# EAGLE design xo106 (EAGLE 7.7.0)
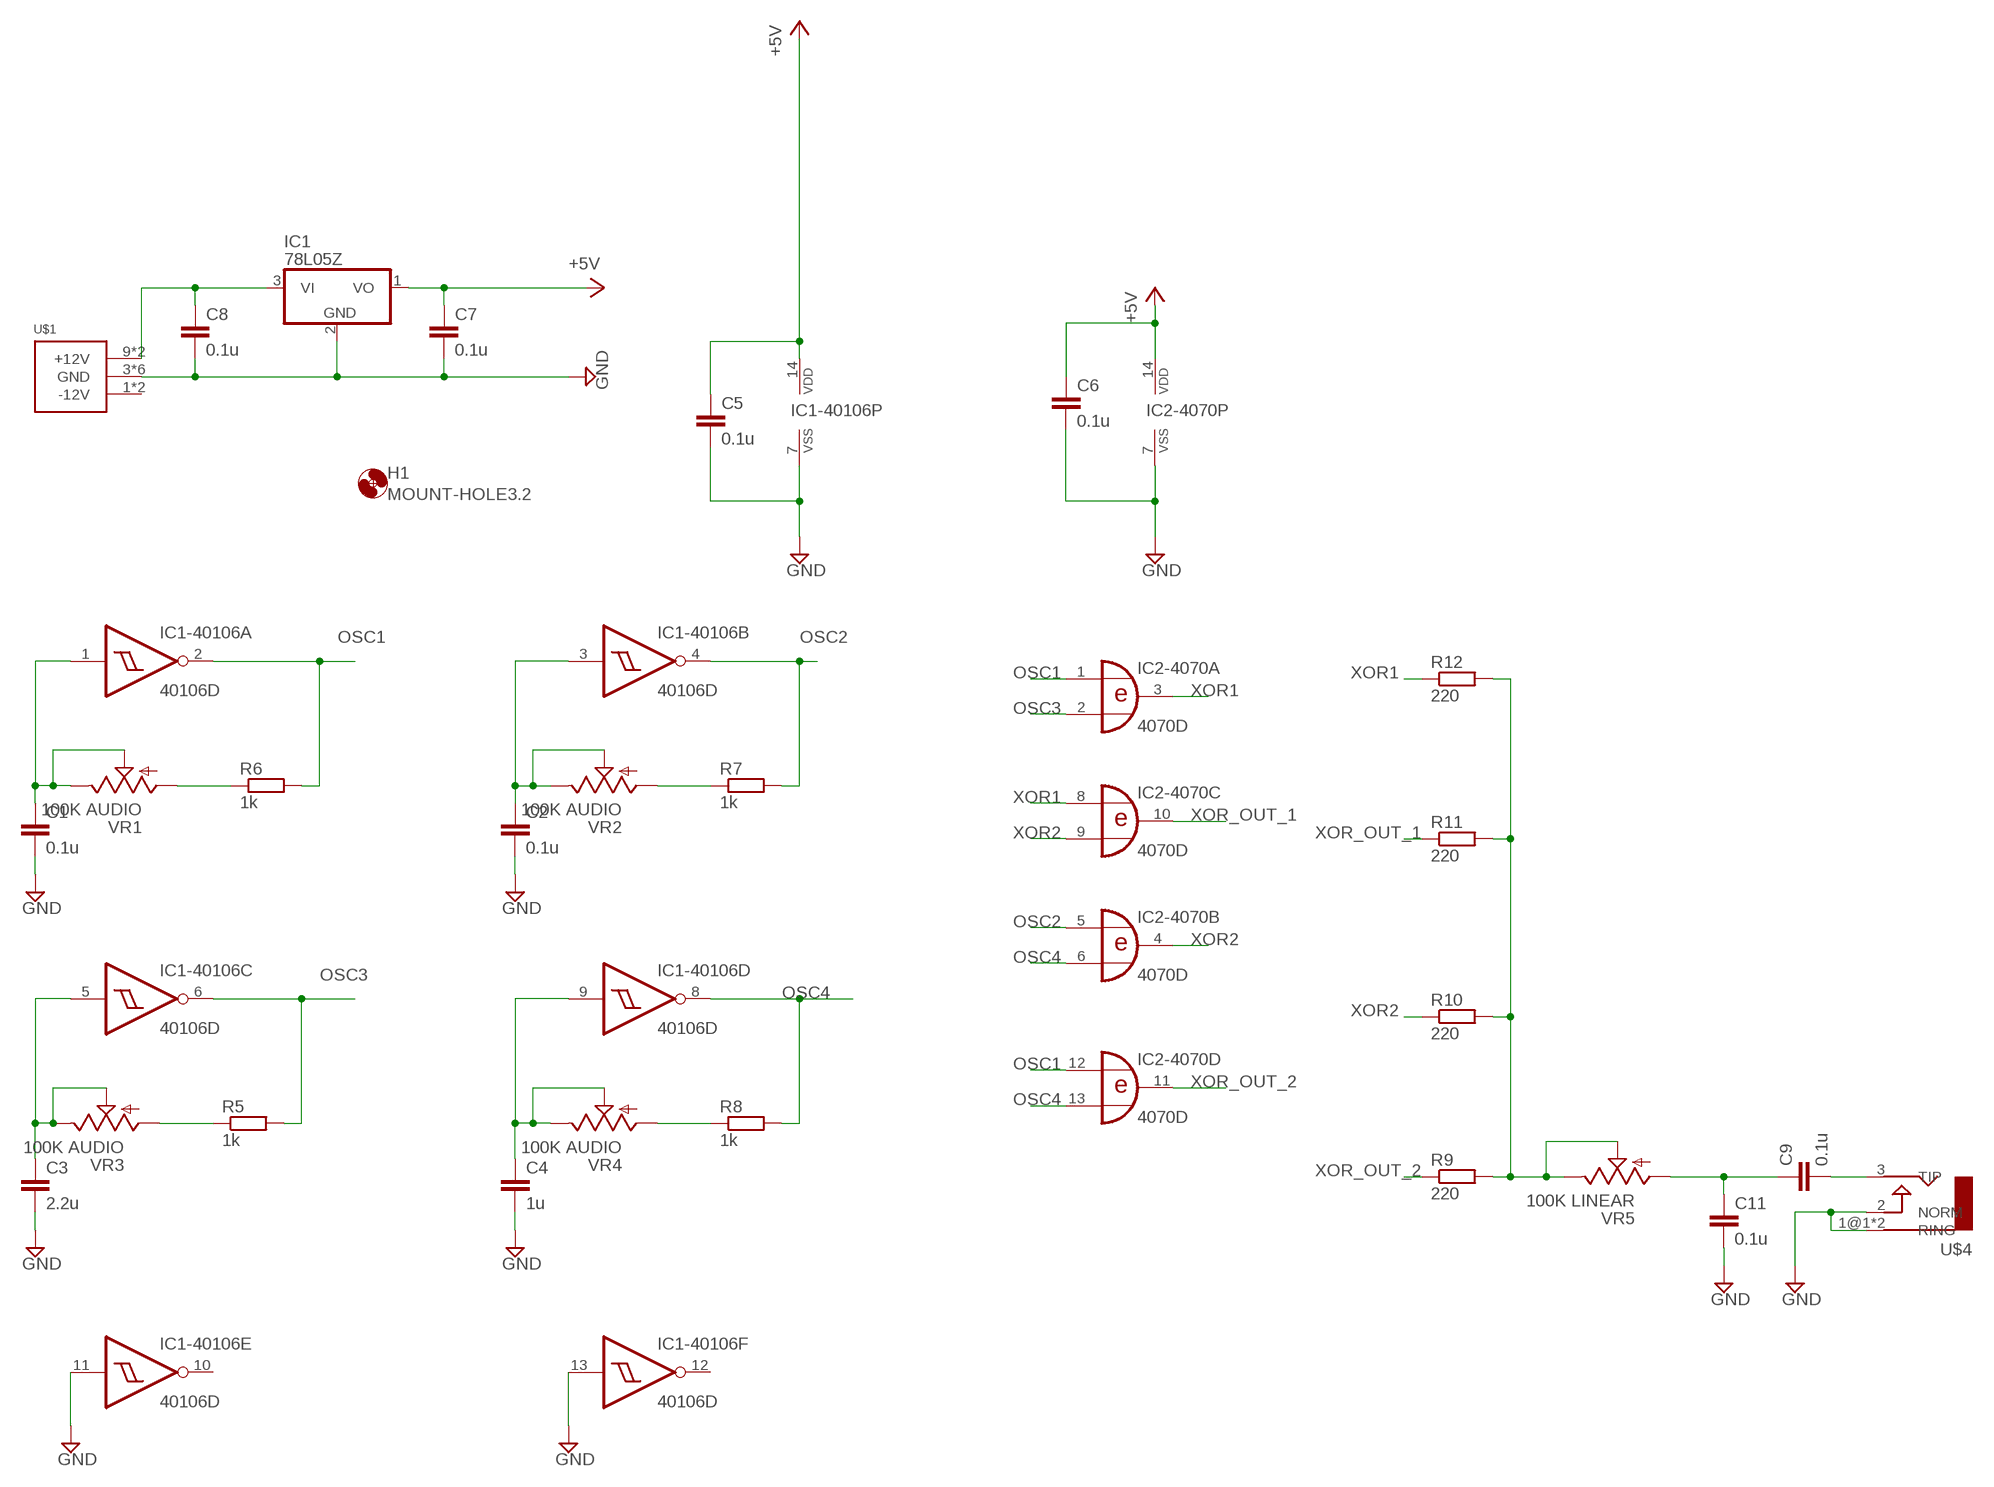
[diagram p0: schematic, sheet 1]

## Parts
C1  0.1u  C-EUC0805  [C0805]
C2  0.1u  C-EUC0805  [C0805]
C3  2.2u  C-EUC0805  [C0805]
C4  1u  C-EUC0805  [C0805]
C5  0.1u  C-EUC0805  [C0805]
C6  0.1u  C-EUC0805  [C0805]
C7  0.1u  C-EUC0805  [C0805]
C8  0.1u  C-EUC0805  [C0805]
C9  0.1u  C-EUC0805  [C0805]
C11  0.1u  C-EU050-025X075  [C050-025X075]
H1  MOUNT-HOLE3.2  [3,2]
IC1  78L05Z  [TO92]
IC1-40106  40106D  [SO14]
IC2-4070  4070D  [SO14]
R5  1k  R-EU_R0805  [R0805]
R6  1k  R-EU_R0805  [R0805]
R7  1k  R-EU_R0805  [R0805]
R8  1k  R-EU_R0805  [R0805]
R9  220  R-EU_R0805  [R0805]
R10  220  R-EU_R0805  [R0805]
R11  220  R-EU_M0805  [M0805]
R12  220  R-EU_R0805  [R0805]
U$1  POWER_SIMPLE10  [POWER_10]
U$4  AUDIO-JACKERTHENVAR  [ERTHENVAR-JACK]
VR1  100K AUDIO  9MM_SNAP-IN_POT_  [9MM_SNAP-IN_POT]
VR2  100K AUDIO  9MM_SNAP-IN_POT_  [9MM_SNAP-IN_POT]
VR3  100K AUDIO  9MM_SNAP-IN_POT_  [9MM_SNAP-IN_POT]
VR4  100K AUDIO  9MM_SNAP-IN_POT_  [9MM_SNAP-IN_POT]
VR5  100K LINEAR  9MM_SNAP-IN_POT_  [9MM_SNAP-IN_POT]

## Nets
+5V: C5.1 C6.1 C7.1 IC1-40106.14(P:VDD) IC1.1(VO) IC2-4070.14(P:VDD)
GND: C1.2 C2.2 C3.2 C4.2 C5.2 C6.2 C7.2 C8.2 C11.2 IC1-40106.7(P:VSS) IC1-40106.11(E:I) IC1-40106.13(F:I) IC1.2(GND) IC2-4070.7(P:VSS) U$1.3(GND) U$1.4(GND) U$1.5(GND) U$1.6(GND) U$1.7(GND) U$1.8(GND) U$4.1@1(RING) U$4.1@2(RING) U$4.2(NORM)
N$1: C9.1 C11.1 VR5.1(A)
N$2: R6.1 VR1.1(A)
N$3: R5.1 VR3.1(A)
N$4: R8.1 VR4.1(A)
N$5: C1.1 IC1-40106.1(A:I) VR1.2(S) VR1.3(E)
N$6: C2.1 IC1-40106.3(B:I) VR2.2(S) VR2.3(E)
N$7: C3.1 IC1-40106.5(C:I) VR3.2(S) VR3.3(E)
N$8: C4.1 IC1-40106.9(D:I) VR4.2(S) VR4.3(E)
N$9: R7.1 VR2.1(A)
N$10: C8.1 IC1.3(VI) U$1.9(+12V) U$1.10(+12V)
N$11: C9.2 U$4.3(TIP)
N$15: R9.2 R10.2 R11.2 R12.2 VR5.2(S) VR5.3(E)
OSC1: IC1-40106.2(A:O) IC2-4070.1(A:I0) IC2-4070.12(D:I0) R6.2
OSC2: IC1-40106.4(B:O) IC2-4070.5(B:I0) R7.2
OSC3: IC1-40106.6(C:O) IC2-4070.2(A:I1) R5.2
OSC4: IC1-40106.8(D:O) IC2-4070.6(B:I1) IC2-4070.13(D:I1) R8.2
XOR1: IC2-4070.3(A:O) IC2-4070.8(C:I0) R12.1
XOR2: IC2-4070.4(B:O) IC2-4070.9(C:I1) R10.1
XOR_OUT_1: IC2-4070.10(C:O) R11.1
XOR_OUT_2: IC2-4070.11(D:O) R9.1
Unconnected: IC1-40106.10(E:O) IC1-40106.12(F:O) U$1.1(-12V) U$1.2(-12V)

## Library data of the parts
C1-C9 C11 = rcl:C-EU: CAPACITOR, European symbol
H1 = holes:MOUNT-HOLE: MOUNTING HOLE with drill center marker
IC1 = linear:78*: Positive VOLTAGE REGULATOR Source: http://cache.national.com/ds/LM/LM78L05.pdf http://www.fairchildsemi.com/ds/LM/LM7805.pdf
IC1-40106 = 40xx:40106: Hex SCHMITT TRIGGER
IC2-4070 = 40xx:4070: Quad 2-input XOR
R5-R12 = resistor:R-EU_: RESISTOR, European symbol
U$1 = eurorack:POWER_SIMPLE
U$4 = erthenvar:AUDIO-JACK: Switching Mono 3.5mm Audio Jack from Erthenvar.
VR1-VR5 = MusicThingModular:9MM_SNAP-IN_POT: 9mm vertical snap-in pot, Alpha / Panasonic style

## Board
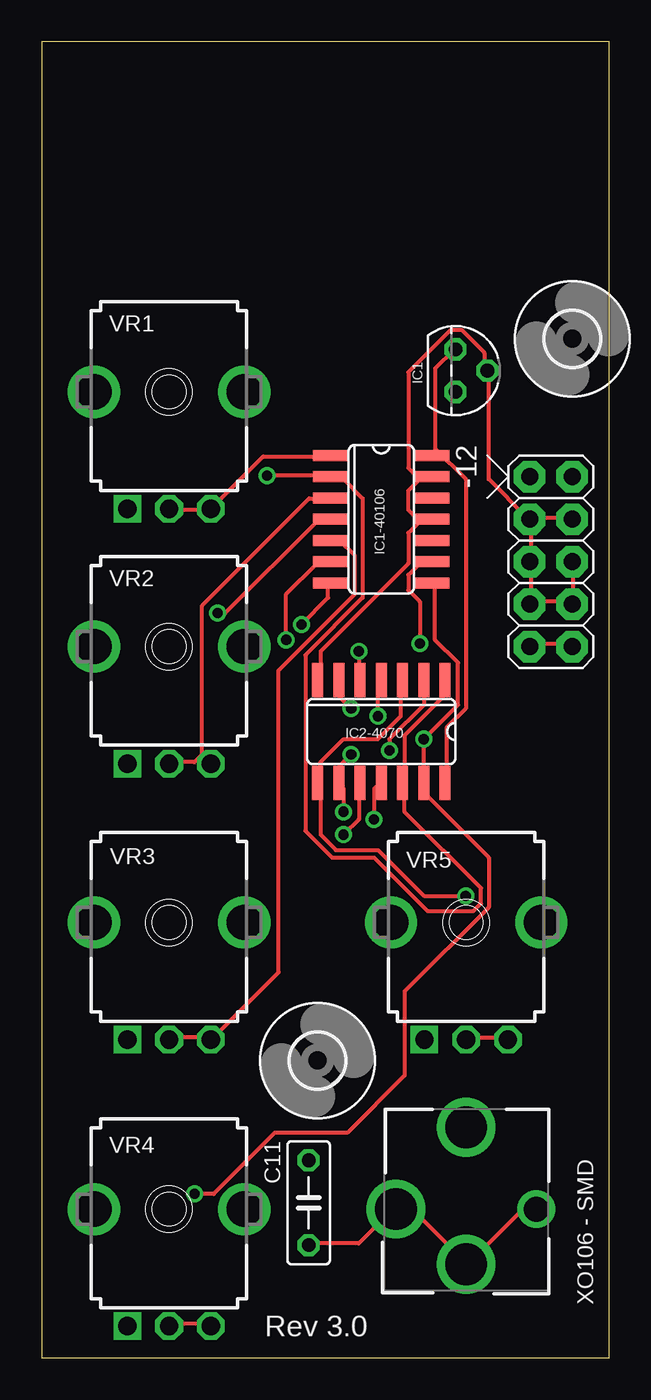
[diagram p1: board, top side]
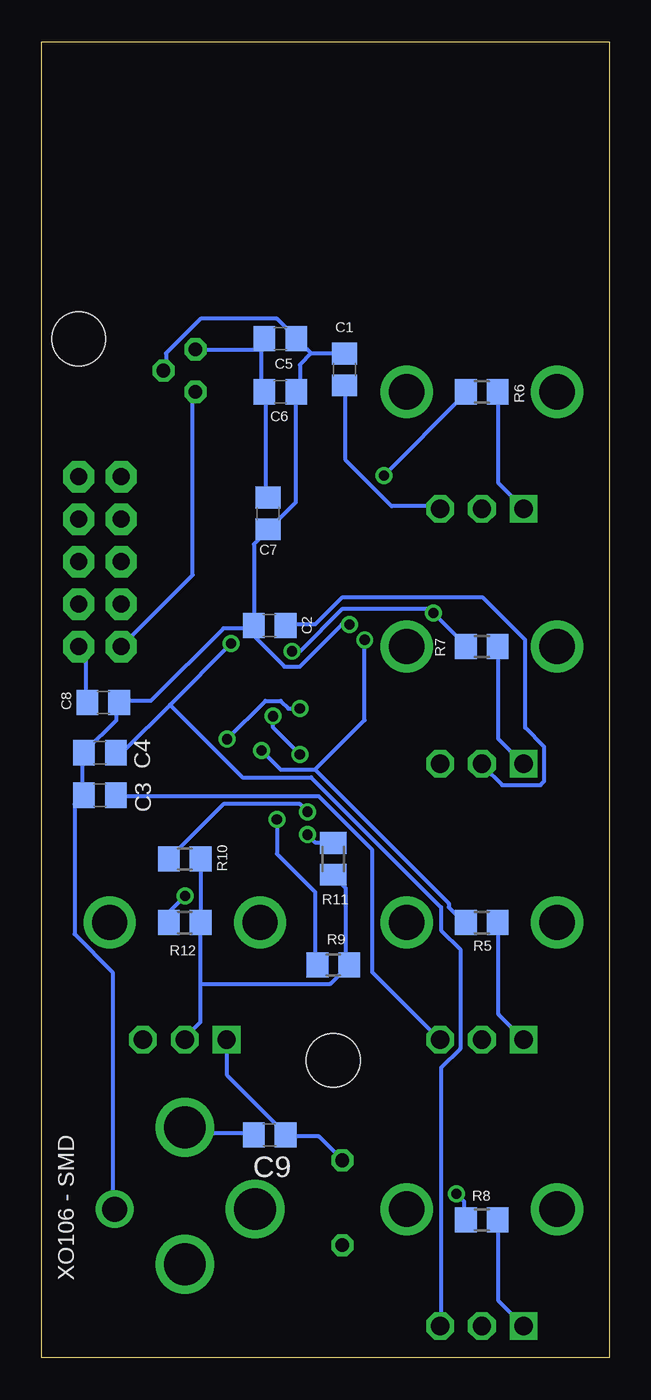
[diagram p2: board, bottom side, seen from below]

Size 33.96 x 78.73 mm. Coordinates in mm from the lower left corner, seen from the top.
Outline: 0,0 33.96,0 33.96,78.73 0,78.73 0,0
Copper layers (1*16): Top 0.035mm / dielectric 1.5mm / Bottom 0.035mm
Design rules "default": minimum track width 10mil, minimum drill 24mil, track to track 8mil, track to pad 8mil, pad to pad 8mil, via to via 8mil, smd to smd 8mil, copper to edge 40mil, drill to drill 8mil, minimum pad ring 10mil, minimum via ring 8mil, stop-mask expansion 4mil, vias tented up to drill 0mil, thermal gap 10mil

### Footprints (pad centres in the part's own frame; a part is rotated, then mirrored left to right if it is on the bottom)
C0805 = smd 1.3 x 1.5: 1 -0.95,0; 2 0.95,0
C050-025X075 = drill 0.813 octagon: 1 -2.54,0; 2 2.54,0
3,2 = hole 3.2: 0,0
TO92 = drill 0.813 octagon: 1 -1.27,0; 2 0,1.905; 3 1.27,0
SO14 = smd 0.66 x 2.032: 1 -3.81,-3.073; 2 -2.54,-3.073; 3 -1.27,-3.073; 4 0,-3.073; 5 1.27,-3.073; 6 2.54,-3.073; 7 3.81,-3.073; 8 3.81,3.073; 9 2.54,3.073; 10 1.27,3.073; 11 0,3.073; 12 -1.27,3.073; 13 -2.54,3.073; 14 -3.81,3.073
R0805 = smd 1.3 x 1.5: 1 -0.95,0; 2 0.95,0
M0805 = smd 1.3 x 1.6: 1 -0.95,0; 2 0.95,0
POWER_10 = drill 1.016 pad 1.88 octagon: 1 -5.08,-1.27; 2 -5.08,1.27; 3 -2.54,-1.27; 4 -2.54,1.27; 5 0,-1.27; 6 0,1.27; 7 2.54,-1.27; 8 2.54,1.27; 9 5.08,-1.27; 10 5.08,1.27
ERTHENVAR-JACK = drill 2.5: 1@1 -4.2,0; 2 0,-3.3; 3 0,4.9 | drill 1.5: 1@2 4.2,0
9MM_SNAP-IN_POT = drill 1.1 square: 1 -2.5,-7 | drill 1.1 octagon: 2 0,-7; 3 2.5,-7 | drill 2.1 pad 2.794: CHASSIS1 -4.5,0; CHASSIS2 4.5,0

### Placement (x,y rotation side)
C1  15.83,59.12 90 bottom
C2  20.32,43.82 180 bottom
C3  30.48,33.66 180 bottom
C4  30.48,36.2 180 bottom
C5  19.68,60.96 0 bottom
C6  19.68,57.79 0 bottom
C7  20.42,50.51 270 bottom
C8  30.27,39.21 0 bottom
C9  20.32,13.34 180 bottom
C11  15.97,9.27 270 top
H1  31.75,60.96 0 top
H2  MOUNT-HOLE3.2  [3,2]  16.51,17.78 0 top
IC1  24.77,59.05 270 top
IC1-40106  20.32,50.16 270 top
IC2-4070  20.32,37.47 180 top
R5  7.62,26.04 180 bottom
R6  7.62,57.79 180 bottom
R7  7.62,42.55 180 bottom
R8  7.62,8.26 180 bottom
R9  16.51,23.49 0 bottom
R10  25.4,29.84 0 bottom
R11  16.51,29.84 270 bottom
R12  25.4,26.04 0 bottom
U$1  30.48,47.62 270 top
U$4  25.4,8.89 0 top
VR1  7.62,57.79 0 top
VR2  7.62,42.55 0 top
VR3  7.62,26.04 0 top
VR4  7.62,8.89 0 top
VR5  25.4,26.04 0 top

### Tracks (layer width: path | path; a pad name or v marks a point on that pad's centre or on a via)
+5V
  Top 0.254: 23.55,54.38 23.55,59.18 24.69,60.33 IC1.1 | 23.55,54.38 23.55,54.15 IC1-40106.14 | 23.55,54.38 25.38,52.55 25.38,38.84 24.23,37.69 24.23,34.49 IC2-4070.14
  Bottom 0.254: C7.1 20.57,51.64 20.57,57.58 C6.1 20.8,57.81 20.8,60.33 | 20.8,60.33 20.8,60.78 C5.1 20.8,60.33 | IC1.1 20.8,60.33
GND  (via drill 0.61)
  Top 0.254: 22.63,50.04 21.95,49.35 21.95,47.52 16.69,42.27 16.69,40.66 IC2-4070.7 | 22.63,50.04 23.32,50.04 IC1-40106.11 22.63,50.04 | 22.63,52.55 23.32,52.55 IC1-40106.13 22.63,52.55 | 22.63,52.55 21.95,51.87 21.95,50.72 22.63,50.04 | 29.26,45.24 29.26,47.52 U$1.5 29.26,47.75 29.26,50.04 U$1.3 | U$1.6 31.77,47.52 31.77,45.24 U$1.8 31.55,45.24 29.26,45.24 | 29.26,45.24 U$1.7 | U$1.3 29.03,50.27 26.75,52.55 26.75,58.95 IC1.2 26.52,59.18 26.52,60.1 25.15,61.47 24.46,61.47 21.95,58.95 21.95,53.24 22.63,52.55 | U$1.4 31.55,50.27 29.26,50.27 U$1.3 | C11.2 16,6.83 18.97,6.83 21.03,8.89 U$4.1@1 22.17,8.89 25.38,5.69 U$4.2 25.6,5.69 28.8,8.89 U$4.1@2 | v15.54,43.87 17.14,45.47 17.14,46.15 IC1-40106.7
  Bottom 0.254: 17.83,60.1 16,60.1 C1.2 | 17.83,60.1 18.52,60.78 C5.2 18.75,61.01 19.89,62.15 24.46,62.15 26.52,60.1 26.52,59.18 IC1.2 | 17.83,60.1 18.52,59.41 18.52,57.81 C6.2 18.75,57.58 18.75,51.18 20.34,49.58 C7.2 20.57,49.35 21.26,48.67 21.26,43.87 C2.2 | v15.54,43.87 16,43.87 18.52,41.35 19.43,41.35 21.26,43.18 21.26,43.64 C2.2 | C2.2 21.49,43.64 23.09,43.64 27.43,39.29 29.26,39.29 C8.2 29.49,39.07 29.49,38.15 31.32,36.32 C4.2 31.55,36.09 31.55,33.81 C3.2 31.55,33.58 32,33.12 32,25.35 29.72,23.06 29.72,8.89 U$4.1@2
N$1
  Bottom 0.254: C11.1 16,11.86 17.37,13.23 19.2,13.23 C9.1 19.43,13.46 22.86,16.89 22.86,18.95 VR5.1
N$2
  Bottom 0.254: R6.1 6.63,57.58 6.63,52.32 5.26,50.95 VR1.1
N$3
  Bottom 0.254: R5.1 6.63,26.04 6.63,20.55 5.26,19.18 VR3.1
N$4
  Bottom 0.254: R8.1 6.63,8.2 6.63,3.4 5.26,2.03 VR4.1
N$5
  Top 0.254: IC1-40106.1 17.14,53.92 13.26,53.92 10.29,50.95 VR1.3 10.06,50.72 7.77,50.72 VR1.2
  Bottom 0.254: C1.1 15.77,58.04 15.77,53.7 13.03,50.95 10.29,50.95 VR1.3
N$6
  Top 0.254: 9.6,36.09 9.6,45.01 16,51.41 17.14,51.41 IC1-40106.3 | 9.6,36.09 10.06,35.64 VR2.3 9.6,36.09 | 9.6,36.09 9.14,35.64 7.77,35.64 VR2.2
  Bottom 0.254: C2.1 19.2,43.87 17.6,43.87 16,45.47 7.54,45.47 5.03,42.95 5.03,37.69 3.89,36.55 3.89,34.49 4.12,34.27 6.4,34.27 7.54,35.41 VR2.2
N$7
  Top 0.254: IC1-40106.5 17.83,48.9 18.75,47.98 18.75,45.7 14.17,41.12 14.17,23.06 10.29,19.18 VR3.3 10.06,19.18 7.77,19.18 VR3.2
  Bottom 0.254: C3.1 29.49,33.58 17.37,33.58 14.17,30.38 14.17,23.06 10.29,19.18 VR3.3
N$8  (via drill 0.61)
  Top 0.254: VR4.2 7.77,2.03 10.06,2.03 VR4.3 | v22.63,42.72 22.63,45.24 21.95,45.92 21.95,46.84 22.63,47.52 23.32,47.52 IC1-40106.9
  Bottom 0.254: v22.63,42.72 26.29,39.07 | 26.29,39.07 29.03,36.32 29.49,36.32 C4.1 | 26.29,39.07 21.95,34.72 17.83,34.72 10.06,26.95 10.06,25.58 8.91,24.43 8.91,18.49 10.06,17.35 10.06,2.03 VR4.3
N$9
  Bottom 0.254: R7.1 6.63,42.49 6.63,37.01 5.26,35.64 VR2.1
N$10
  Top 0.254: U$1.10 31.55,42.72 29.26,42.72 U$1.9
  Bottom 0.254: C8.1 31.32,39.29 31.32,42.27 31.55,42.49 U$1.10 | U$1.9 24.92,46.84 24.92,57.58 IC1.3
N$11
  Bottom 0.254: C9.2 21.49,13.46 25.15,13.46 25.38,13.69 U$4.3
N$15
  Top 0.254: VR5.3 27.89,19.18 25.6,19.18 VR5.2
  Bottom 0.254: R11.2 16.46,28.78 15.77,28.09 15.77,23.52 R9.2 15.77,23.29 16.69,22.38 24.46,22.38 | R12.2 24.46,29.69 R10.2 | 24.46,22.38 24.46,20.09 25.38,19.18 VR5.2 | 24.46,22.38 R12.2 | R12.2
OSC1  (via drill 0.61)
  Top 0.254: IC2-4070.1 24,40.44 24,39.52 21.72,37.24 21.72,34.49 IC2-4070.12 21.72,34.27 21.72,32.66 26.29,28.09 26.29,27.18 25.83,26.72 23.09,26.72 19.89,29.92 17.37,29.92 15.77,31.52 15.77,42.04 19.2,45.47 19.2,51.41 18.06,52.55 17.37,52.55 IC1-40106.2 17.14,52.78 v13.49,52.78
  Bottom 0.254: v13.49,52.78 8.69,57.58 R6.2
OSC2  (via drill 0.61)
  Top 0.254: v10.52,44.55 10.97,44.55 16.46,50.04 17.14,50.04 IC1-40106.4 | v18.97,42.27 18.97,40.66 IC2-4070.5
  Bottom 0.254: R7.2 8.69,42.72 v10.52,44.55 10.74,44.78 16,44.78 18.52,42.27 v18.97,42.27
OSC3  (via drill 0.61)
  Top 0.254: v20.8,36.32 20.8,37.01 22.86,39.07 IC2-4070.2 | v14.63,42.95 14.63,45.7 16.46,47.52 17.14,47.52 IC1-40106.6
  Bottom 0.254: 17.6,35.18 9.6,27.18 9.6,26.95 8.69,26.04 R5.2 | 17.6,35.18 19.66,35.18 v20.8,36.32 | v14.63,42.95 14.63,38.15 17.6,35.18
OSC4  (via drill 0.61)
  Top 0.254: v9.14,9.8 10.29,9.8 13.95,13.46 18.29,13.46 21.72,16.89 21.72,21.92 26.75,26.95 26.75,29.92 22.86,33.81 IC2-4070.13 v22.86,37.01 24.92,39.07 24.92,41.58 23.55,42.95 23.55,46.15 IC1-40106.8 | v18.52,38.84 17.83,39.52 17.83,40.44 IC2-4070.6
  Bottom 0.254: v9.14,9.8 8.69,9.35 8.69,8.43 R8.2 | v18.52,38.84 19.2,38.84 19.66,39.29 20.57,39.29 v22.86,37.01
XOR1  (via drill 0.61)
  Top 0.254: v25.38,27.63 22.86,27.63 20.12,30.38 17.6,30.38 16.69,31.29 16.69,34.27 IC2-4070.8 16.69,34.49 16.69,35.64 18.06,37.01 20.12,37.01 21.49,38.38 21.49,40.44 IC2-4070.3
  Bottom 0.254: v25.38,27.63 26.29,26.72 26.29,26.04 R12.1
XOR2  (via drill 0.61)
  Top 0.254: v18.06,32.66 18.06,34.04 17.83,34.27 IC2-4070.9 17.83,34.49 17.83,35.41 v18.52,36.09 | v20.12,38.38 20.12,40.44 IC2-4070.4
  Bottom 0.254: v18.06,32.66 18.52,33.12 23.09,33.12 26.29,29.92 R10.1 | v20.12,38.38 20.12,37.69 v18.52,36.09
XOR_OUT_1  (via drill 0.61)
  Top 0.254: v18.06,31.29 18.97,32.21 18.97,34.27 IC2-4070.10
  Bottom 0.254: v18.06,31.29 17.6,30.84 16.69,30.84 R11.1
XOR_OUT_2  (via drill 0.61)
  Top 0.254: v19.89,32.21 19.89,34.04 20.12,34.27 IC2-4070.11
  Bottom 0.254: v19.89,32.21 19.89,30.15 17.6,27.86 17.6,23.52 R9.1

### Text on the board
tNames: XO106 - SMD | Rev 3.0
bNames: XO106 - SMD